# Altium schematic sheet 5_Current_Voltage_Sensor.SchDoc
size A4
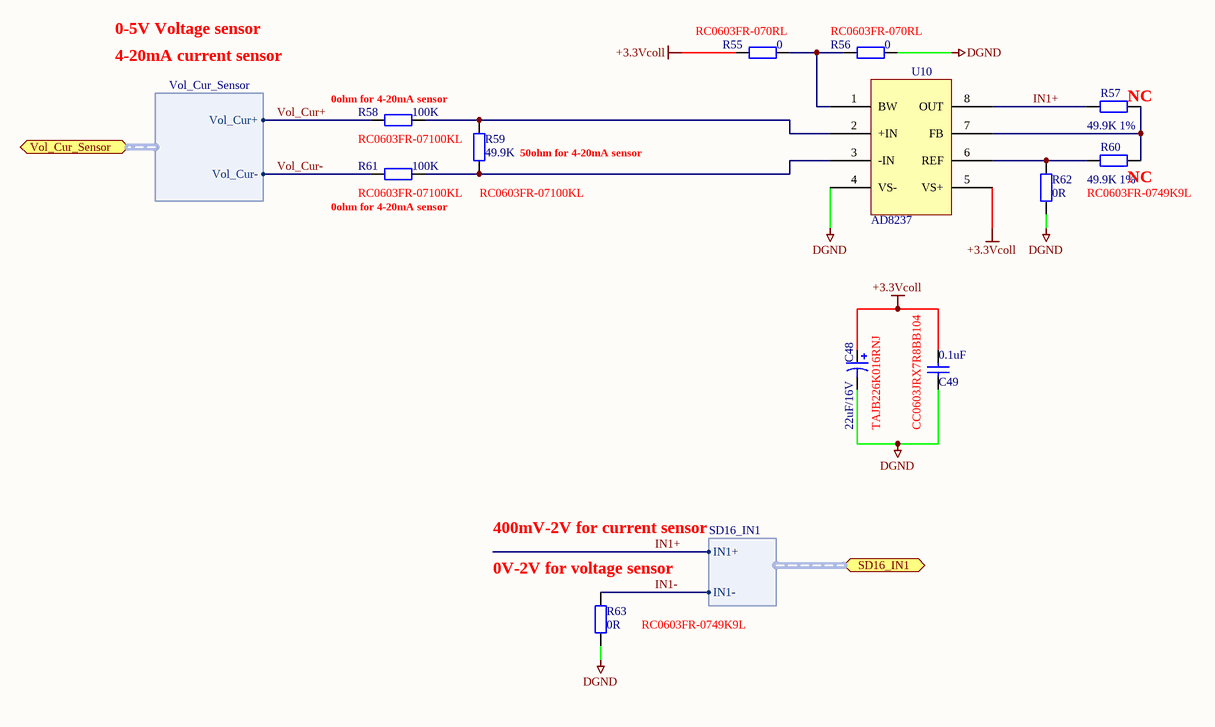
[diagram p0: 5_Current_Voltage_Sensor.SchDoc]

## Parts
C48  22uF/16V  Part No.: TAJB226K016RNJ  [CB3528]
C49  0.1uF  Type No.: CC0603JRX7R8BB104  [CC0603]
R55  0  Type No.: RC0603FR-070RL  [CC0603]
R56  0  Type No.: RC0603FR-070RL  [CC0603]
R57  49.9K 1%  [CC0603]
R58  100K  Type No.: RC0603FR-07100KL  [CC0603]
R59  49.9K  Type No.: RC0603FR-07100KL  [CC0603]
R60  49.9K 1%  [CC0603]
R61  100K  Type No.: RC0603FR-07100KL  [CC0603]
R62  0R  Type No.: RC0603FR-0749K9L  [CC0603]
R63  0R  Type No.: RC0603FR-0749K9L  [CC0603]
U10  AD8237  [MSOP8]

## Ports
SD16_IN1 (harness SD16_IN1), Vol_Cur_Sensor (harness Vol_Cur_Sensor)

## Harnesses
SD16_IN1: IN1+, IN1-
Vol_Cur_Sensor: Vol_Cur+, Vol_Cur-

## Nets
+3.3Vcoll: C48.1 C49.2 R55.2 U10.5(VS+)
DGND: C48.2 C49.1 R56.1 R62.2 R63.2 U10.4(VS-)
IN1+: R57.2 U10.8(OUT) ; port SD16_IN1.IN1+
IN1-: R63.1 ; port SD16_IN1.IN1-
Vol_Cur+: R58.2 ; port Vol_Cur_Sensor.Vol_Cur+
Vol_Cur-: R61.2 ; port Vol_Cur_Sensor.Vol_Cur-
NetR55_1: R55.1 R56.2 U10.1(BW)
NetR57_1: R57.1 R60.1 U10.7(FB)
NetR58_1: R58.1 R59.1 U10.2(+IN)
NetR59_2: R59.2 R61.1 U10.3(-IN)
NetR60_2: R60.2 R62.1 U10.6(REF)

## Notes on the sheet
- 0-5V Voltage sensor
- 4-20mA current sensor
- (near R58) 0ohm for 4-20mA sensor
- (near R57) NC
- (near R59) 50ohm for 4-20mA sensor
- (near R61) 0ohm for 4-20mA sensor
- (near R60) NC
- 400mV-2V for current sensor
- (near R63) 0V-2V for voltage sensor
- 文件版本:
- 原理图名:
- 工 程  名:
- 绘       制:
- 审       核:
- 第   页，共    页
- 日       期:

## Library data of the parts
C48 = Cap Pol1: Polarized Capacitor (Radial)
C49 = Cap: Capacitor
R55 R56 R58 R59 R61-R63 = Res2: Resistor
R57 R60 = Res2: Resistor; Value: 1K; Published: 8-Jun-2000; LatestRevisionDate: 17-Jul-2002; LatestRevisionNote: Re-released for DXP Platform.; PackageReference: AXIAL-0.4; Publisher: Altium Limited
U10 = AD8237: Type No.: AD8237ARMZ